# EAGLE design MSV-front (EAGLE 9.4.0)
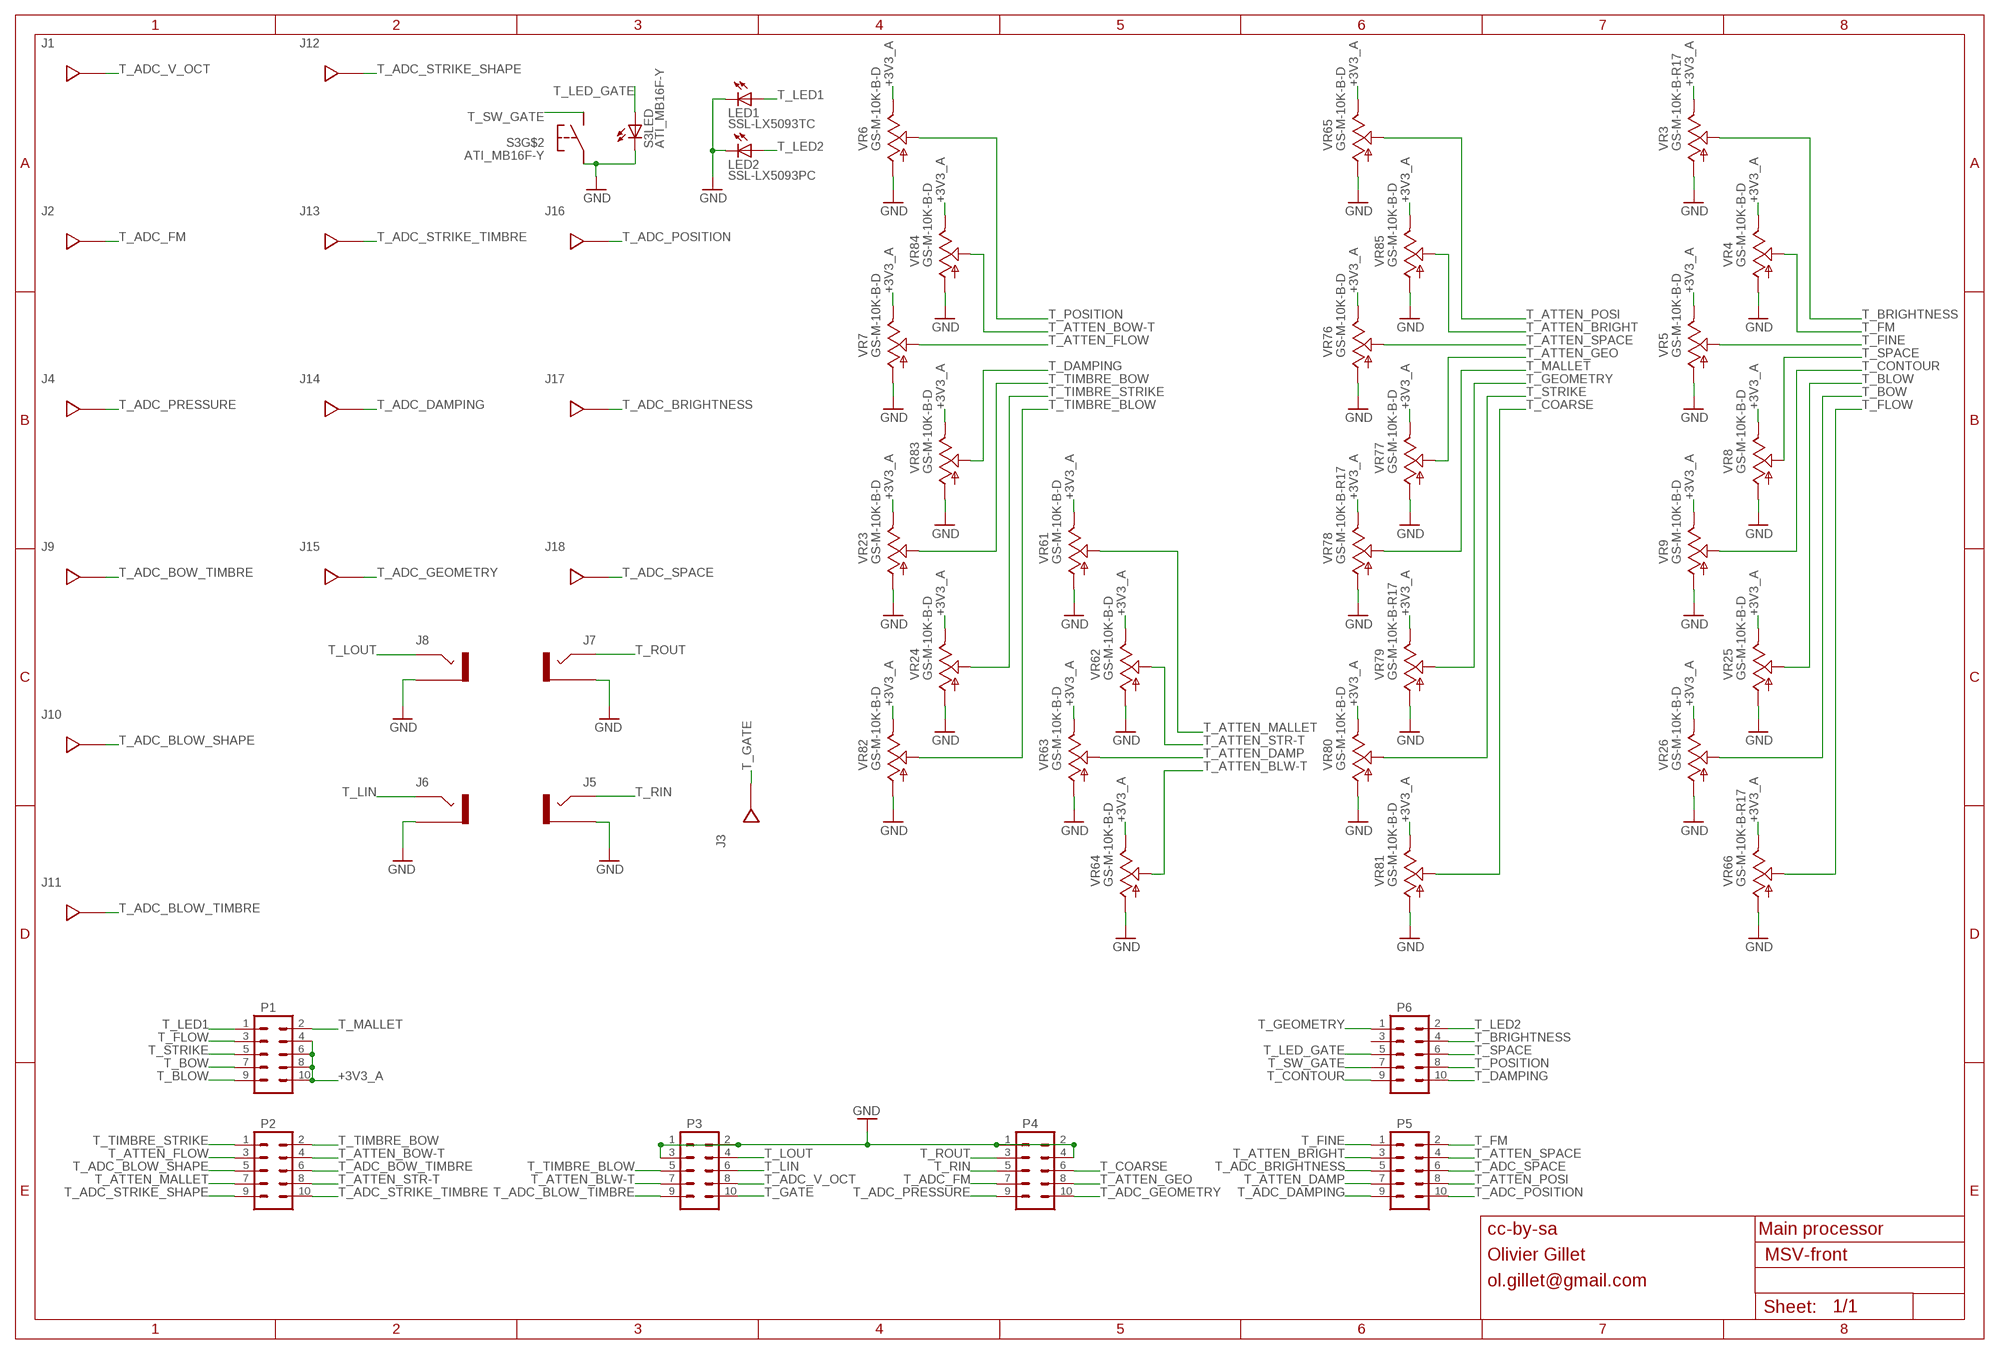
[diagram p0: schematic, sheet 1]

## Parts
J1  BANANA_JACK_GRAY  [JOHNSON_SILK]
J2  BANANA_JACK_BLACK  [JOHNSON_SILK]
J3  BANANA_JACK_ORANGE  [JOHNSON_SILK]
J4  BANANA_JACK_BLACK  [JOHNSON_SILK]
J5  BUCHLA_AUDIO_JACK_ALT  [AUDIO_ALT]
J6  BUCHLA_AUDIO_JACK_ALT  [AUDIO_ALT]
J7  BUCHLA_AUDIO_JACK_ALT  [AUDIO_ALT]
J8  BUCHLA_AUDIO_JACK_ALT  [AUDIO_ALT]
J9  BANANA_JACK_BLACK  [JOHNSON_SILK]
J10  BANANA_JACK_BLACK  [JOHNSON_SILK]
J11  BANANA_JACK_BLACK  [JOHNSON_SILK]
J12  BANANA_JACK_BLACK  [JOHNSON_SILK]
J13  BANANA_JACK_BLACK  [JOHNSON_SILK]
J14  BANANA_JACK_BLACK  [JOHNSON_SILK]
J15  BANANA_JACK_BLACK  [JOHNSON_SILK]
J16  BANANA_JACK_BLACK  [JOHNSON_SILK]
J17  BANANA_JACK_BLACK  [JOHNSON_SILK]
J18  BANANA_JACK_BLACK  [JOHNSON_SILK]
LED1  SSL-LX5093TC  LED_SILK  [LED_SILK]
LED2  SSL-LX5093PC  LED_SILK  [LED_SILK]
P1  M05X2_LOCK_FEMALE  [2X5_LOCK_FEMALE]
P2  M05X2_LOCK_FEMALE  [2X5_LOCK_FEMALE]
P3  M05X2_LOCK_FEMALE  [2X5_LOCK_FEMALE]
P4  M05X2_LOCK_FEMALE  [2X5_LOCK_FEMALE]
P5  M05X2_LOCK_FEMALE  [2X5_LOCK_FEMALE]
P6  M05X2_LOCK_FEMALE  [2X5_LOCK_FEMALE]
S3  ATI_MB16F-Y  [MB16F_SILK]
VR3  GS-M-10K-B-R17  POT_9MM_SNAP-IN__  [9MM_SNAP-IN_POT_SILK]
VR4  GS-M-10K-B-D  POT_9MM_SNAP-IN__  [9MM_SNAP-IN_POT_SILK]
VR5  GS-M-10K-B-D  POT_9MM_SNAP-IN__  [9MM_SNAP-IN_POT_SILK]
VR6  GS-M-10K-B-D  POT_9MM_SNAP-IN__  [9MM_SNAP-IN_POT_SILK]
VR7  GS-M-10K-B-D  POT_9MM_SNAP-IN__  [9MM_SNAP-IN_POT_SILK]
VR8  GS-M-10K-B-D  POT_9MM_SNAP-IN__  [9MM_SNAP-IN_POT_SILK]
VR9  GS-M-10K-B-D  POT_9MM_SNAP-IN__  [9MM_SNAP-IN_POT_SILK]
VR23  GS-M-10K-B-D  POT_9MM_SNAP-IN__  [9MM_SNAP-IN_POT_SILK]
VR24  GS-M-10K-B-D  POT_9MM_SNAP-IN__  [9MM_SNAP-IN_POT_SILK]
VR25  GS-M-10K-B-D  POT_9MM_SNAP-IN__  [9MM_SNAP-IN_POT_SILK]
VR26  GS-M-10K-B-D  POT_9MM_SNAP-IN__  [9MM_SNAP-IN_POT_SILK]
VR61  GS-M-10K-B-D  POT_9MM_SNAP-IN__  [9MM_SNAP-IN_POT_SILK]
VR62  GS-M-10K-B-D  POT_9MM_SNAP-IN__  [9MM_SNAP-IN_POT_SILK]
VR63  GS-M-10K-B-D  POT_9MM_SNAP-IN__  [9MM_SNAP-IN_POT_SILK]
VR64  GS-M-10K-B-D  POT_9MM_SNAP-IN__  [9MM_SNAP-IN_POT_SILK]
VR65  GS-M-10K-B-D  POT_9MM_SNAP-IN__  [9MM_SNAP-IN_POT_SILK]
VR66  GS-M-10K-B-R17  POT_9MM_SNAP-IN__  [9MM_SNAP-IN_POT_SILK]
VR76  GS-M-10K-B-D  POT_9MM_SNAP-IN__  [9MM_SNAP-IN_POT_SILK]
VR77  GS-M-10K-B-D  POT_9MM_SNAP-IN__  [9MM_SNAP-IN_POT_SILK]
VR78  GS-M-10K-B-R17  POT_9MM_SNAP-IN__  [9MM_SNAP-IN_POT_SILK]
VR79  GS-M-10K-B-R17  POT_9MM_SNAP-IN__  [9MM_SNAP-IN_POT_SILK]
VR80  GS-M-10K-B-D  POT_9MM_SNAP-IN__  [9MM_SNAP-IN_POT_SILK]
VR81  GS-M-10K-B-D  POT_9MM_SNAP-IN__  [9MM_SNAP-IN_POT_SILK]
VR82  GS-M-10K-B-D  POT_9MM_SNAP-IN__  [9MM_SNAP-IN_POT_SILK]
VR83  GS-M-10K-B-D  POT_9MM_SNAP-IN__  [9MM_SNAP-IN_POT_SILK]
VR84  GS-M-10K-B-D  POT_9MM_SNAP-IN__  [9MM_SNAP-IN_POT_SILK]
VR85  GS-M-10K-B-D  POT_9MM_SNAP-IN__  [9MM_SNAP-IN_POT_SILK]

## Nets
+3V3_A: P1.4 P1.6 P1.8 P1.10 VR3.3 VR4.3 VR5.3 VR6.3 VR7.3 VR8.3 VR9.3 VR23.3 VR24.3 VR25.3 VR26.3 VR61.3 VR62.3 VR63.3 VR64.3 VR65.3 VR66.3 VR76.3 VR77.3 VR78.3 VR79.3 VR80.3 VR81.3 VR82.3 VR83.3 VR84.3 VR85.3
GND: J5.G J6.G J7.G J8.G LED1.K(C) LED2.K(C) P3.1 P3.2 P3.3 P4.1 P4.2 P4.4 S3.2 S3.4(LED:L2) VR3.1 VR4.1 VR5.1 VR6.1 VR7.1 VR8.1 VR9.1 VR23.1 VR24.1 VR25.1 VR26.1 VR61.1 VR62.1 VR63.1 VR64.1 VR65.1 VR66.1 VR76.1 VR77.1 VR78.1 VR79.1 VR80.1 VR81.1 VR82.1 VR83.1 VR84.1 VR85.1
T_ADC_BLOW_SHAPE: J10.1 P2.5
T_ADC_BLOW_TIMBRE: J11.1 P3.9
T_ADC_BOW_TIMBRE: J9.1 P2.6
T_ADC_BRIGHTNESS: J17.1 P5.5
T_ADC_DAMPING: J14.1 P5.9
T_ADC_FM: J2.1 P4.7
T_ADC_GEOMETRY: J15.1 P4.10
T_ADC_POSITION: J16.1 P5.10
T_ADC_PRESSURE: J4.1 P4.9
T_ADC_SPACE: J18.1 P5.6
T_ADC_STRIKE_SHAPE: J12.1 P2.9
T_ADC_STRIKE_TIMBRE: J13.1 P2.10
T_ADC_V_OCT: J1.1 P3.8
T_ATTEN_BLW-T: P3.7 VR64.2
T_ATTEN_BOW-T: P2.4 VR84.2
T_ATTEN_BRIGHT: P5.3 VR85.2
T_ATTEN_DAMP: P5.7 VR63.2
T_ATTEN_FLOW: P2.3 VR7.2
T_ATTEN_GEO: P4.8 VR77.2
T_ATTEN_MALLET: P2.7 VR61.2
T_ATTEN_POSI: P5.8 VR65.2
T_ATTEN_SPACE: P5.4 VR76.2
T_ATTEN_STR-T: P2.8 VR62.2
T_BLOW: P1.9 VR25.2
T_BOW: P1.7 VR26.2
T_BRIGHTNESS: P6.4 VR3.2
T_COARSE: P4.6 VR81.2
T_CONTOUR: P6.9 VR9.2
T_DAMPING: P6.10 VR83.2
T_FINE: P5.1 VR5.2
T_FLOW: P1.3 VR66.2
T_FM: P5.2 VR4.2
T_GATE: J3.1 P3.10
T_GEOMETRY: P6.1 VR79.2
T_LED1: LED1.A P1.1
T_LED2: LED2.A P6.2
T_LED_GATE: P6.5 S3.3(LED:L1)
T_LIN: J6.S P3.6
T_LOUT: J8.S P3.4
T_MALLET: P1.2 VR78.2
T_POSITION: P6.8 VR6.2
T_RIN: J5.S P4.5
T_ROUT: J7.S P4.3
T_SPACE: P6.6 VR8.2
T_STRIKE: P1.5 VR80.2
T_SW_GATE: P6.7 S3.1
T_TIMBRE_BLOW: P3.5 VR82.2
T_TIMBRE_BOW: P2.2 VR23.2
T_TIMBRE_STRIKE: P2.1 VR24.2
Unconnected: P6.3

## Notes on the sheet
- cc-by-sa | Main processor
- Olivier Gillet
- ol.gillet@gmail.com

## Library data of the parts
J1 = Electrosmith-Interface:BANANA_JACK; COLOR: GRAY; IPN: Banana Jack - Gray
J2 J4 J9-J18 = Electrosmith-Interface:BANANA_JACK; COLOR: BLACK; IPN: Banana Jack - Black
J3 = Electrosmith-Interface:BANANA_JACK; COLOR: ORANGE; IPN: Banana Jack - Orange
J5 = Electrosmith-Interface:BUCHLA_AUDIO_JACK; GND: GND; IPN: Buchla Audio TJ No Switching; LABEL: RES
J6 = Electrosmith-Interface:BUCHLA_AUDIO_JACK; GND: GND; IPN: Buchla Audio TJ No Switching; LABEL: EXC
J7 = Electrosmith-Interface:BUCHLA_AUDIO_JACK; GND: GND; IPN: Buchla Audio TJ No Switching; LABEL: OUT2
J8 = Electrosmith-Interface:BUCHLA_AUDIO_JACK; GND: GND; IPN: Buchla Audio TJ No Switching; LABEL: OUT1
LED1 LED2 = Electrosmith-Interface:LED
P1-P6 = Electrosmith-Connectors:M05X2: Header 5x2 Standard 10-pin dual row 0.1" header. Commonly used with AVR-ISP. Use with Spark Fun Electronics SKU: PRT-00778; LABEL: FEMALE
S3 = Electrosmith-Interface:ATI_MB16F-Y
VR3-VR9 VR23-VR26 VR61-VR66 VR76-VR85 = Electrosmith-Interface:POT_9MM_SNAP-IN_: 9mm vertical snap-in pot, Alpha / Panasonic style

## Net classes
0 default: width 0.203 mm

## Board
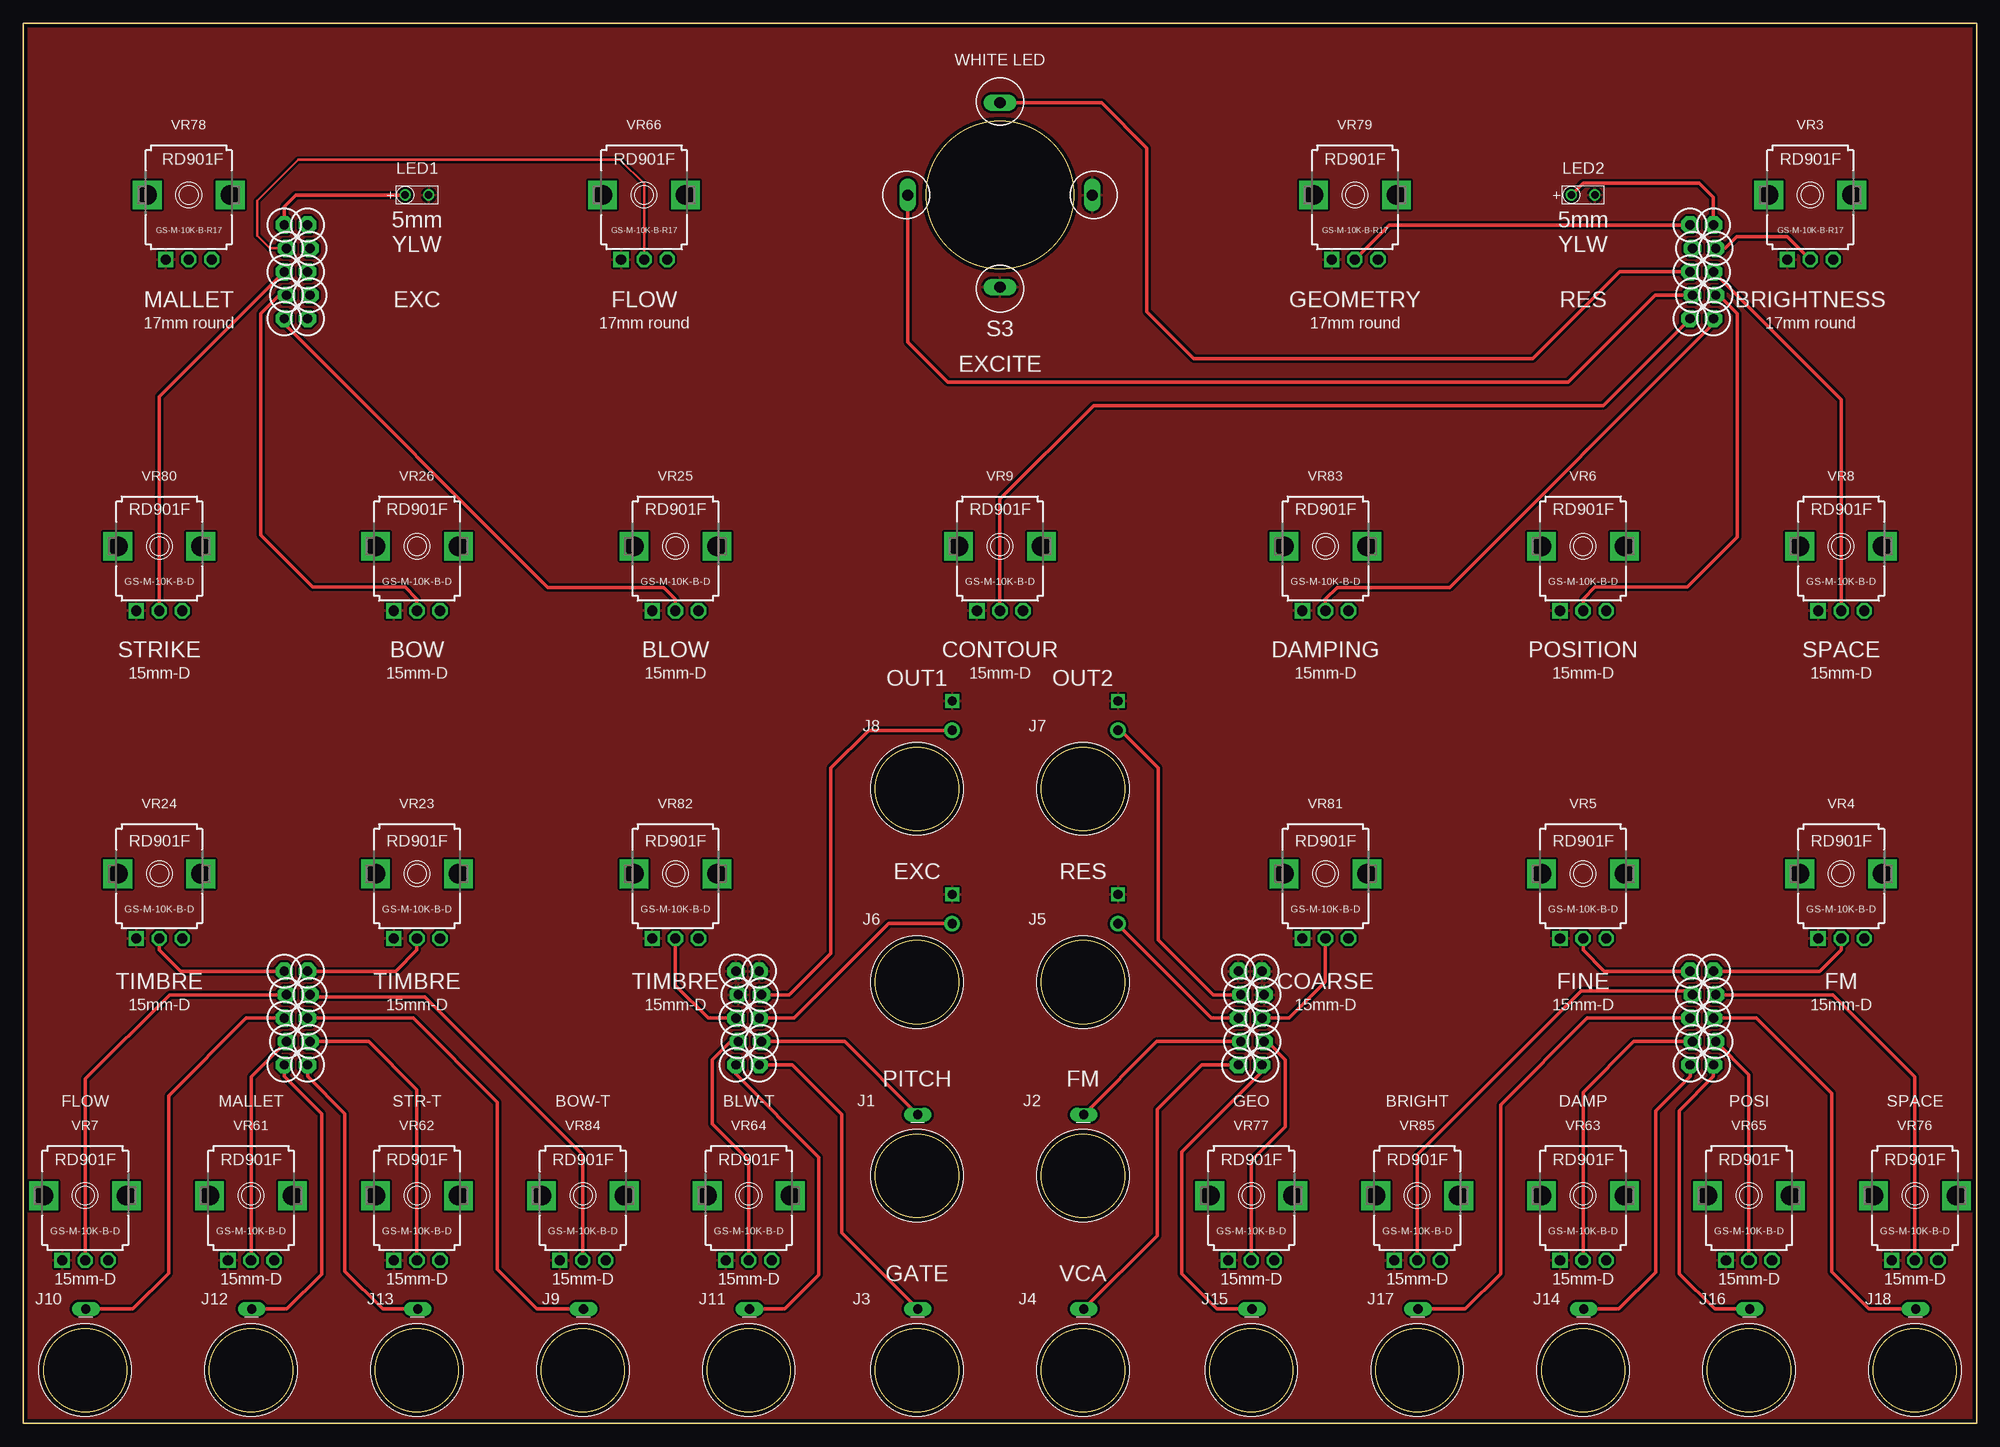
[diagram p1: board, top side]
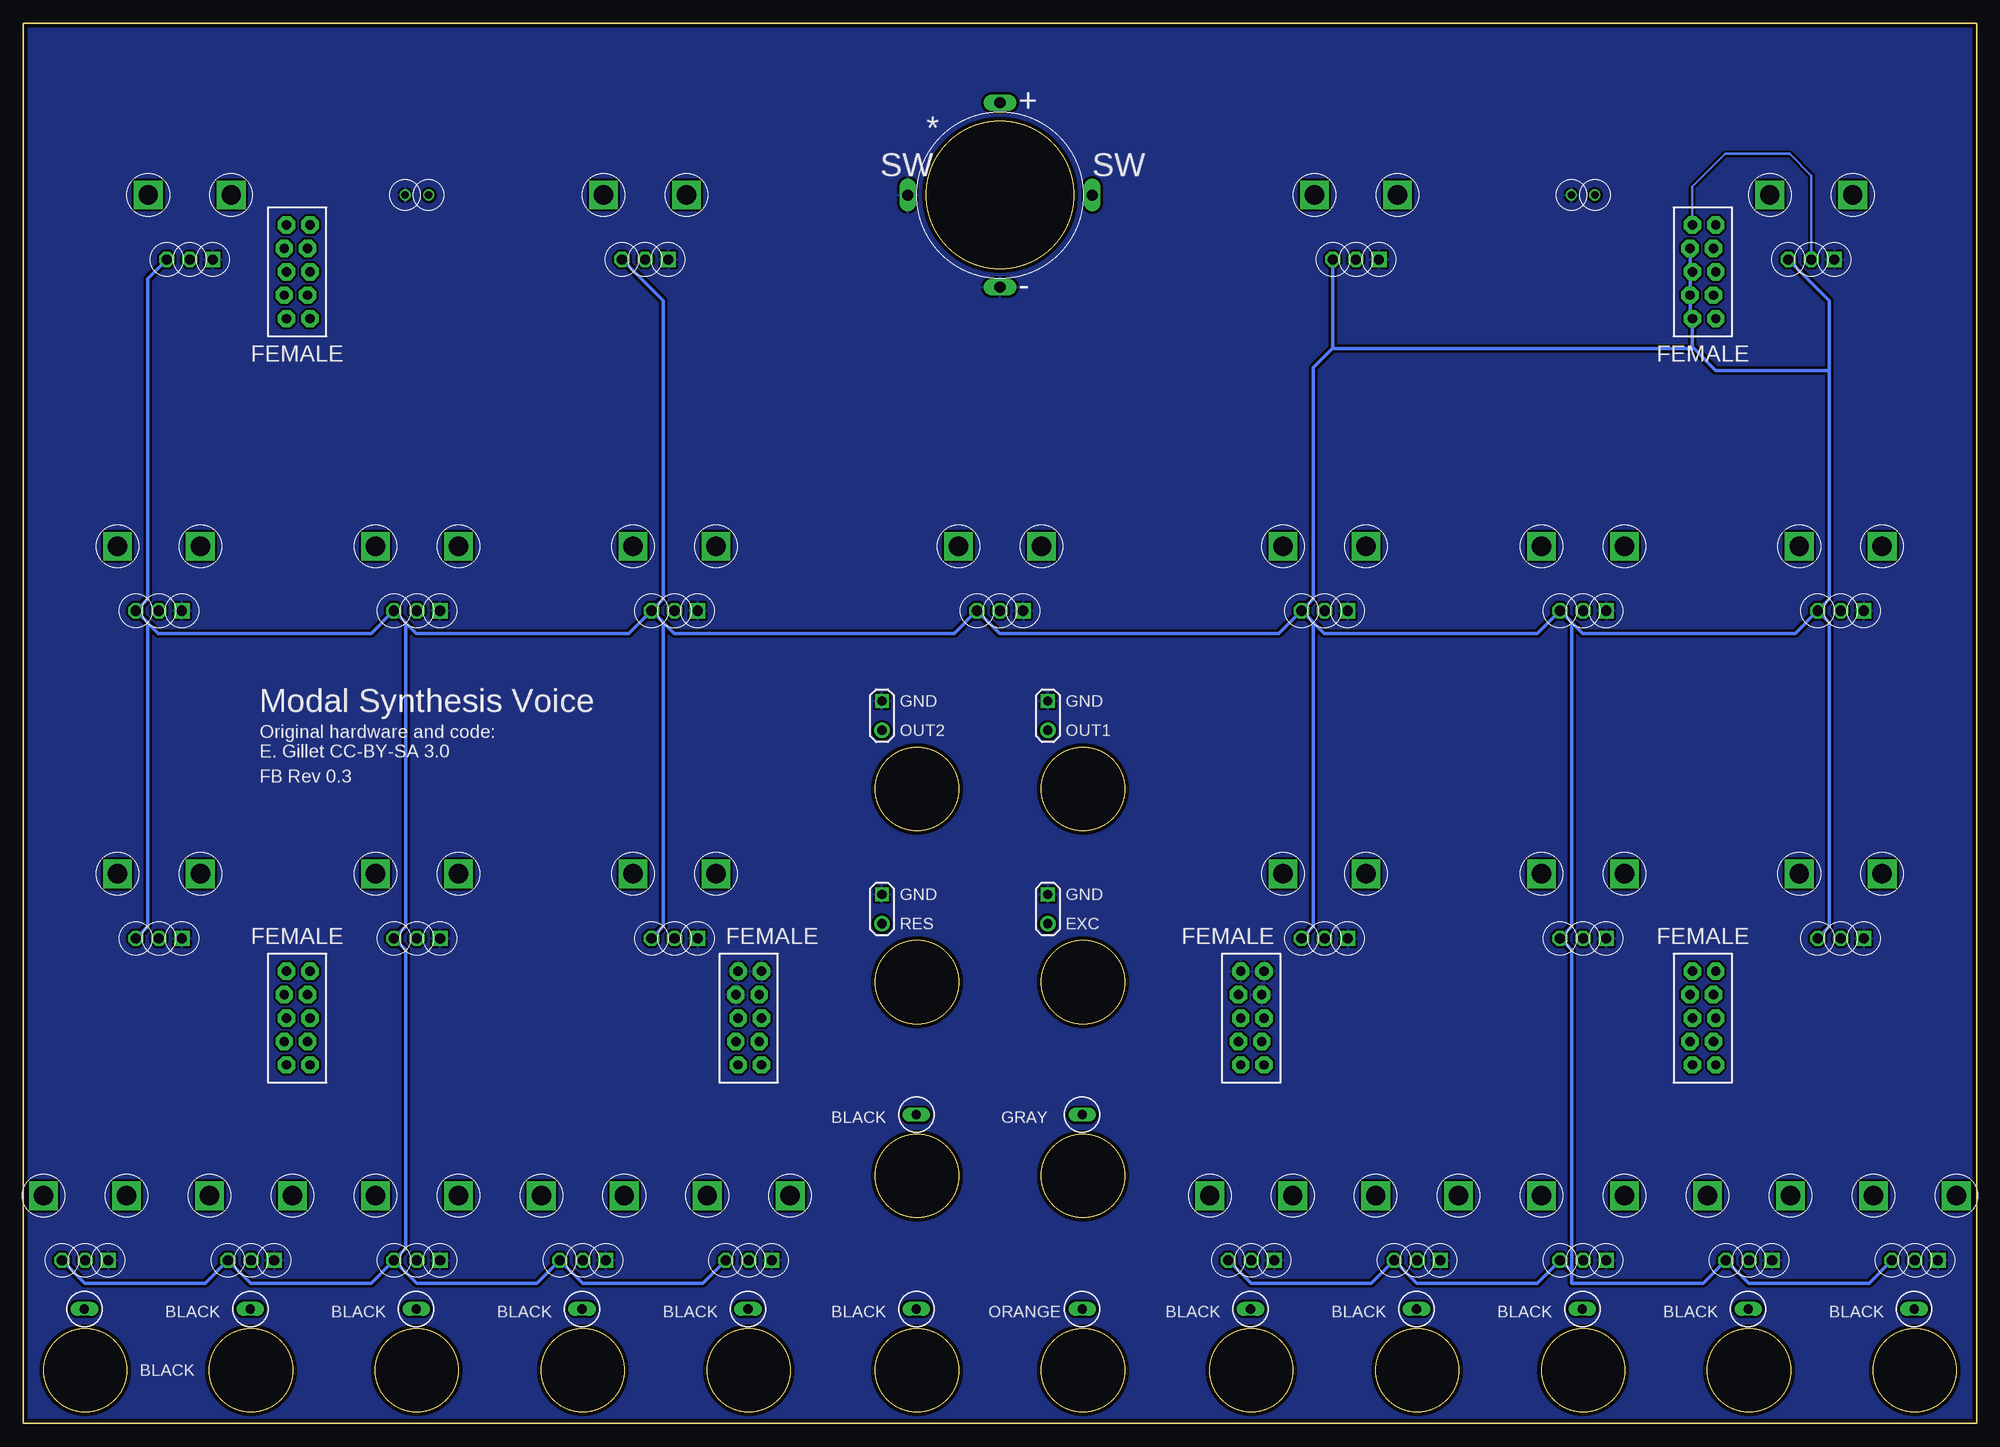
[diagram p2: board, bottom side, seen from below]

Size 212 x 152 mm. Coordinates in mm from the lower left corner, seen from the top.
Outline: 0,0 212,0 212,152 0,152 0,0
Copper layers (1*16): Top 0.0356mm / dielectric 1.5011mm / Bottom 0.0356mm
Design rules "ES_DRC_MaskedVias": minimum track width 6mil, minimum drill 13mil, track to track 6mil, track to pad 6mil, pad to pad 6mil, via to via 6mil, smd to smd 6mil, copper to edge 15mil, drill to drill 6mil, minimum pad ring 7mil, minimum via ring 7mil, stop-mask expansion 3mil, vias tented up to drill 16mil, thermal gap 10mil

### Footprints (pad centres in the part's own frame; a part is rotated, then mirrored left to right if it is on the bottom)
JOHNSON_SILK = drill 1 long: 1 0.08,6.635
AUDIO_ALT = drill 1 square: G 3.81,9.525 | drill 1 pad 1.676: S 3.81,6.35
LED_SILK = drill 0.813: A -1.27,0; K 1.27,0
2X5_LOCK_FEMALE = drill 1.016 pad 1.88 octagon: 1 -1.397,5.08; 2 1.143,5.08; 3 -1.143,2.54; 4 1.397,2.54; 5 -1.397,0; 6 1.143,0; 7 -1.143,-2.54; 8 1.397,-2.54; 9 -1.397,-5.08; 10 1.143,-5.08
MB16F_SILK = drill 1.2 long: 1 10,0; 2 -10,0; 3 0,10; 4 0,-10
9MM_SNAP-IN_POT_SILK = drill 1.1 square: 1 -2.5,-7 | drill 1.1 octagon: 2 0,-7; 3 2.5,-7 | drill 2.1 square: CHASSIS1 -4.5,0; CHASSIS2 4.5,0

### Placement (x,y rotation side)
J1  97,26.89 0 top
J2  115,26.89 0 top
J3  97,5.79 0 top
J4  115,5.79 0 top
J5  115,47.9 0 top
J6  97,47.9 0 top
J7  115,68.88 0 top
J8  97,68.88 0 top
J9  60.74,5.79 0 top
J10  6.74,5.79 0 top
J11  78.74,5.79 0 top
J12  24.74,5.79 0 top
J13  42.74,5.79 0 top
J14  169.26,5.79 0 top
J15  133.27,5.79 0 top
J16  187.27,5.79 0 top
J17  151.27,5.79 0 top
J18  205.27,5.79 0 top
LED1  42.74,133.33 0 top
LED2  169.26,133.33 0 top
P1  29.74,125 0 top
P2  29.74,44 0 top
P3  78.74,44 0 top
P4  133.27,44 0 top
P5  182.27,44 0 top
P6  182.27,125 0 top
S3  106,133.33 0 bottom
VR3  193.91,133.33 0 top
VR4  197.26,59.65 0 top
VR5  169.26,59.65 0 top
VR6  169.26,95.21 0 top
VR7  6.74,24.71 0 top
VR8  197.26,95.21 0 top
VR9  106,95.21 0 top
VR23  42.74,59.65 0 top
VR24  14.78,59.65 0 top
VR25  70.78,95.21 0 top
VR26  42.74,95.21 0 top
VR61  24.74,24.71 0 top
VR62  42.74,24.71 0 top
VR63  169.26,24.71 0 top
VR64  78.74,24.71 0 top
VR65  187.27,24.71 0 top
VR66  67.39,133.33 0 top
VR76  205.27,24.71 0 top
VR77  133.27,24.71 0 top
VR78  17.98,133.33 0 top
VR79  144.51,133.33 0 top
VR80  14.78,95.21 0 top
VR81  141.31,59.65 0 top
VR82  70.78,59.65 0 top
VR83  141.31,95.21 0 top
VR84  60.74,24.71 0 top
VR85  151.27,24.71 0 top

### Tracks (layer width: path | path; a pad name or v marks a point on that pad's centre or on a via)
+3V3_A
  Bottom 0.406: VR80.3 16.01,89.48 16.01,114.3 | VR25.3 72.01,89.48 72.01,114.59 69.97,116.64 | VR25.3 72.01,86.94 72.01,53.92 VR82.3 | VR83.3 142.54,89.48 142.54,121.87 VR79.3 | VR8.3 198.49,89.48 198.49,124.25 VR3.3 | VR81.3 142.54,53.92 142.54,86.94 VR83.3 | VR8.3 198.49,86.94 198.49,53.92 VR4.3 | VR6.3 170.49,86.94 170.49,53.92 VR5.3 170.49,51.38 170.49,18.98 VR63.3 | VR26.3 43.97,86.94 43.97,53.92 VR23.3 43.97,51.38 43.97,16.51 | 43.97,16.51 43.97,15.24 29.71,15.24 VR61.3 24.76,15.24 11.71,15.24 VR7.3 | 43.97,16.51 45.24,17.78 VR62.3 47.71,15.24 60.76,15.24 VR84.3 65.71,15.24 78.76,15.24 VR64.3 | VR80.3 19.73,85.76 42.79,85.76 VR26.3 | VR26.3 47.69,85.76 70.83,85.76 VR25.3 | VR25.3 75.73,85.76 106.05,85.76 VR9.3 110.95,85.76 141.36,85.76 VR83.3 | VR83.3 146.26,85.76 169.31,85.76 VR6.3 | VR6.3 174.22,85.76 197.31,85.76 VR8.3 | VR63.3 169.29,15.24 156.24,15.24 VR85.3 151.29,15.24 138.24,15.24 VR77.3 | VR63.3 174.24,15.24 187.29,15.24 VR65.3 192.24,15.24 205.29,15.24 VR76.3 | VR80.3 16.01,86.94 16.01,53.92 VR24.3 | P1.4 31.14,125.25 P1.6 31.14,124.75 P1.8 31.14,120.17 P1.10 30.88,116.84 30.68,116.64 | 30.68,116.64 28.34,114.3 16.01,114.3 | 30.68,116.64 69.97,116.64 | 69.97,116.64 69.89,116.72 VR66.3 | 16.01,114.3 16.01,121.87 VR78.3
GND
  pour Top (isolate 0.254): 0,152 0,0 212,0 212,152
  pour Bottom (isolate 0.254): 0,152 0,0 212,0 212,152
T_ADC_BLOW_SHAPE
  Top 0.406: J10.1 11.9,12.42 15.78,16.31 15.78,35.56 24.22,44 P2.5
T_ADC_BLOW_TIMBRE
  Top 0.406: J11.1 82.63,12.42 86.36,16.15 86.36,28.9 77.34,37.92 P3.9
T_ADC_BOW_TIMBRE
  Top 0.406: J9.1 55.74,12.42 51.44,16.72 51.44,34.87 42.31,44 P2.6
T_ADC_BRIGHTNESS
  Top 0.406: J17.1 156.49,12.42 160.31,16.24 160.31,34.58 169.73,44 P5.5
T_ADC_DAMPING
  Top 0.406: P5.9 180.87,37.65 177.16,33.95 177.16,16.43 173.15,12.42 J14.1
T_ADC_FM
  Top 0.406: J2.1 122.99,41.46 P4.7
T_ADC_GEOMETRY
  Top 0.406: J15.1 129.54,12.42 125.73,16.23 125.73,29.48 134.41,38.16 P4.10
T_ADC_POSITION
  Top 0.406: P5.10 183.41,37.65 179.71,33.95 179.71,16.25 183.54,12.42 J16.1
T_ADC_PRESSURE
  Top 0.406: J4.1 123.04,20.38 123.04,34.09 127.87,38.92 P4.9
T_ADC_SPACE
  Top 0.406: J18.1 200.27,12.42 196.22,16.47 196.22,35.81 188.03,44 P5.6
T_ADC_STRIKE_SHAPE
  Top 0.406: P2.9 28.34,37.65 32.38,33.61 32.38,16.18 28.63,12.42 J12.1
T_ADC_STRIKE_TIMBRE
  Top 0.406: P2.10 30.88,37.65 34.92,33.61 34.92,16.5 39.01,12.42 J13.1
T_ADC_V_OCT
  Top 0.406: J1.1 89.17,41.46 P3.8
T_ATTEN_BLW-T
  Top 0.406: P3.7 76.78,41.46 74.78,39.46 74.78,32.54 78.74,28.58 VR64.2
T_ATTEN_BOW-T
  Top 0.406: VR84.2 60.74,29.14 43.59,46.29 31.14,46.29 P2.4
T_ATTEN_BRIGHT
  Top 0.406: VR85.2 151.27,29.14 169.05,46.92 180.74,46.92 P5.3
T_ATTEN_DAMP
  Top 0.406: VR63.2 169.26,35.95 174.77,41.46 P5.7
T_ATTEN_FLOW
  Top 0.406: VR7.2 6.74,37.38 15.89,46.54 P2.3
T_ATTEN_GEO
  Top 0.406: P4.8 134.97,41.46 136.97,39.46 136.97,32.2 133.27,28.49 VR77.2
T_ATTEN_MALLET
  Top 0.406: VR61.2 24.74,37.6 P2.7
T_ATTEN_POSI
  Top 0.406: VR65.2 187.27,37.86 P5.8
T_ATTEN_SPACE
  Top 0.406: VR76.2 205.27,37.64 196.36,46.54 P5.4
T_ATTEN_STR-T
  Top 0.406: VR62.2 42.74,36.21 37.48,41.46 P2.8
T_BLOW
  Top 0.406: VR25.2 70.78,89.48 69.51,90.75 56.95,90.75 28.34,119.36 P1.9
T_BOW
  Top 0.406: VR26.2 42.74,89.48 41.46,90.76 31.45,90.76 25.78,96.43 25.78,120.46 27.78,122.46 P1.7
T_BRIGHTNESS
  Top 0.406: VR3.2 191.44,128.81 185.93,128.81 184.66,127.54 P6.4
T_COARSE
  Top 0.406: VR81.2 141.31,47.9 137.41,44 P4.6
T_CONTOUR
  Top 0.406: VR9.2 106,100.33 116.16,110.49 171.44,110.49 P6.9
T_DAMPING
  Top 0.406: P6.10 183.41,119.36 154.8,90.75 142.58,90.75 141.31,89.48 VR83.2
T_FINE
  Top 0.406: VR5.2 169.26,51.38 171.57,49.08 P5.1
T_FLOW
  Top 0.254: P1.3 26.77,127.54 25.4,128.91 25.4,132.72 29.84,137.16 64.77,137.16 67.39,134.54 VR66.2
T_FM
  Top 0.406: VR4.2 197.26,51.38 194.96,49.08 P5.2
T_GATE
  Top 0.406: J3.1 88.83,20.68 88.83,33.55 83.46,38.92 P3.10
T_GEOMETRY
  Top 0.406: VR79.2 148.25,130.08 P6.1
T_LED1
  Top 0.406: P1.1 28.34,132.08 29.59,133.33 LED1.A
T_LED2
  Top 0.406: P6.2 183.41,133.08 181.87,134.62 169.28,134.62 LED2.A
T_LED_GATE
  Top 0.406: S3.3 117.02,143.33 121.92,138.43 121.92,120.65 127,115.57 163.83,115.57 173.26,125 P6.5
T_LIN
  Top 0.406: P3.6 83.69,44 93.94,54.25 J6.S
T_LOUT
  Top 0.406: J8.S 91.74,75.23 87.63,71.12 87.63,51.03 83.14,46.54 P3.4
T_MALLET
  Bottom 0.254: P1.2 30.88,134.22 27.3,137.79 20.32,137.79 17.98,135.45 VR78.2
T_POSITION
  Top 0.406: VR6.2 169.26,89.48 170.54,90.76 180.55,90.76 185.97,96.18 185.97,120.46 183.97,122.46 P6.8
T_RIN
  Top 0.406: P4.5 128.9,44 118.81,54.09 J5.S
T_ROUT
  Top 0.406: J7.S 119.08,75.23 123.19,71.12 123.19,52.47 129.12,46.54 P4.3
T_SPACE
  Top 0.406: VR8.2 197.26,111.14 P6.6
T_STRIKE
  Top 0.406: VR80.2 14.78,111.44 P1.5
T_SW_GATE
  Top 0.406: P6.7 177.07,122.46 167.64,113.03 100.33,113.03 96,117.36 S3.1
T_TIMBRE_BLOW
  Top 0.406: P3.5 74.34,44 70.78,47.56 VR82.2
T_TIMBRE_BOW
  Top 0.406: VR23.2 42.74,51.38 40.44,49.08 P2.2
T_TIMBRE_STRIKE
  Top 0.406: VR24.2 14.78,51.38 17.09,49.08 P2.1

### Text on the board
tPlace: WHITE LED | RD901F | RD901F | RD901F | RD901F | 5mm / YLW | 5mm / YLW | MALLET | EXC | FLOW | GEOMETRY | RES | BRIGHTNESS | 17mm round | 17mm round | S3 | 17mm round | 17mm round | EXCITE | RD901F | RD901F | RD901F | RD901F | RD901F | RD901F | RD901F | STRIKE | BOW | BLOW | CONTOUR | DAMPING | POSITION | SPACE | 15mm-D | 15mm-D | 15mm-D | OUT1 | 15mm-D | OUT2 | 15mm-D | 15mm-D | 15mm-D | RD901F | RD901F | RD901F | RD901F | RD901F | RD901F | EXC | RES | TIMBRE | TIMBRE | TIMBRE | COARSE | FINE | FM | 15mm-D | 15mm-D | 15mm-D | 15mm-D | 15mm-D | 15mm-D | PITCH | FM | FLOW | MALLET | STR-T | BOW-T | BLW-T | GEO | BRIGHT | DAMP | POSI | SPACE | RD901F | RD901F | RD901F | RD901F | RD901F | RD901F | RD901F | RD901F | RD901F | RD901F | 15mm-D | 15mm-D | 15mm-D | 15mm-D | 15mm-D | GATE | VCA | 15mm-D | 15mm-D | 15mm-D | 15mm-D | 15mm-D
bPlace: Modal Synthesis Voice | Original hardware and code: / E. Gillet CC-BY-SA 3.0 | FB Rev 0.3